# EAGLE design Si1132_breakout (EAGLE 7.2.0)
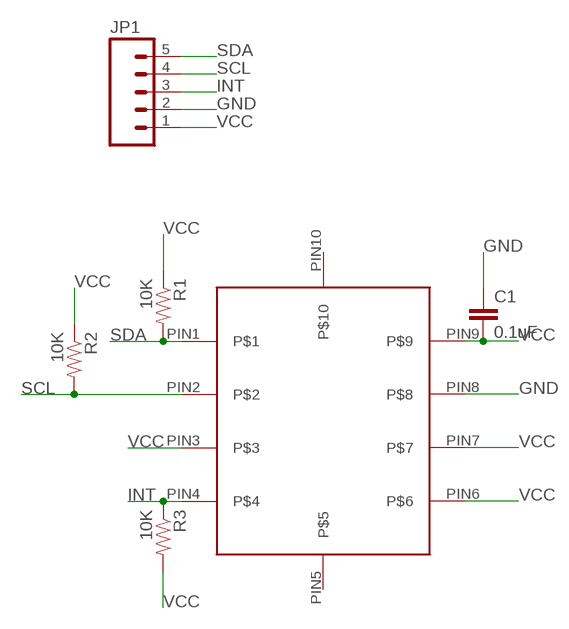
[diagram p0: schematic, sheet 1]

## Parts
C1  0.1uF  CAP0603-CAP  [0603-CAP]
JP1  M05PTH  [1X05]
R1  10K  RESISTOR0603  [0603-RES]
R2  10K  RESISTOR0603  [0603-RES]
R3  10K  RESISTOR0603  [0603-RES]
U$1  SI1132  [SI1132]

## Nets
GND: C1.1 JP1.2 U$1.PIN8
INT: JP1.3 R3.1 U$1.PIN4
SCL: JP1.4 R2.2 U$1.PIN2
SDA: JP1.5 R1.2 U$1.PIN1
VCC: C1.2 JP1.1 R1.1 R2.1 R3.2 U$1.PIN3 U$1.PIN6 U$1.PIN7 U$1.PIN9
Unconnected: U$1.PIN5 U$1.PIN10

## Library data of the parts
C1 = SparkFun-Capacitors:CAP: Capacitor Standard 0603 ceramic capacitor, and 0.1" leaded capacitor.
JP1 = SparkFun-Connectors:M05: Header 5 Standard 5-pin 0.1" header. Use with straight break away headers (SKU : PRT-00116), right angle break away headers (PRT-00553), swiss pins (PRT-00743), machine pins (PRT-00117), and female headers (PRT-00115). Molex polarized connector foot print use with SKU : PRT-08230 with associated crimp pins and housings.
R1-R3 = SparkFun-Resistors:RESISTOR: Resistor Basic schematic elements and footprints for 0603, 1206, and PTH resistors.
U$1 = awqua_eagle_library:SI1132

## Board
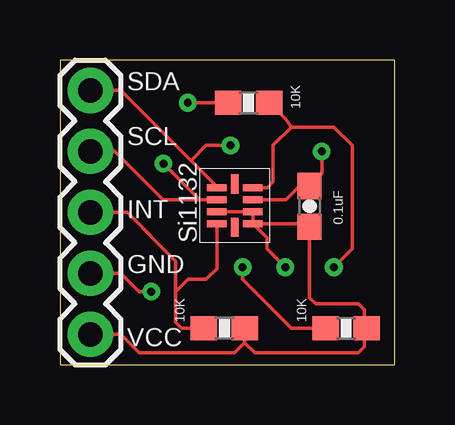
[diagram p1: board, top side]
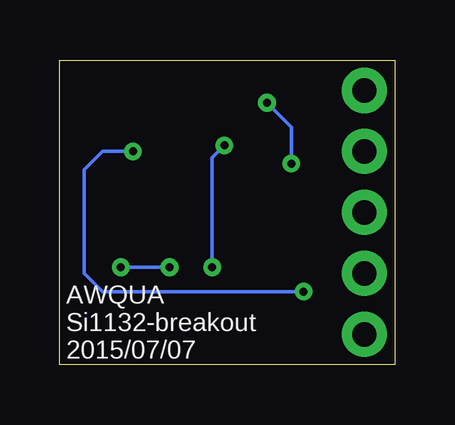
[diagram p2: board, bottom side, seen from below]

Size 13.97 x 12.7 mm. Coordinates in mm from the lower left corner, seen from the top.
Outline: 0,0 13.97,0 13.97,12.7 0,12.69 0,0
Copper layers (1*16): Top 0.035mm / dielectric 1.5mm / Bottom 0.035mm
Design rules "default": minimum track width 10mil, minimum drill 24mil, track to track 8mil, track to pad 8mil, pad to pad 8mil, via to via 8mil, smd to smd 8mil, copper to edge 40mil, drill to drill 8mil, minimum pad ring 10mil, minimum via ring 8mil, stop-mask expansion 4mil, vias tented up to drill 0mil, thermal gap 10mil

### Footprints (pad centres in the part's own frame; a part is rotated, then mirrored left to right if it is on the bottom)
0603-CAP = smd 1.1 x 1: 1 -0.85,0; 2 0.85,0
1X05 = drill 1.016 pad 1.88: 1 0,0; 2 2.54,0; 3 5.08,0; 4 7.62,0; 5 10.16,0
0603-RES = smd 1.1 x 1: 1 -0.85,0; 2 0.85,0
SI1132 = smd 0.8 x 0.3: PIN1 0.7,2.3; PIN2 0.7,1.8; PIN3 0.7,1.3; PIN4 0.7,0.8; PIN6 2.2,0.8; PIN7 2.2,1.3; PIN8 2.2,1.8; PIN9 2.2,2.3 | smd 0.3 x 0.8: PIN5 1.45,0.65; PIN10 1.45,2.45

### Placement (x,y rotation side)
C1  10.41,6.6 270 top
JP1  1.27,1.27 90 top
R1  11.94,1.52 180 top
R2  7.87,10.92 180 top
R3  6.86,1.52 0 top
U$1  5.84,5.08 0 top

### Tracks (layer width: path | path; a pad name or v marks a point on that pad's centre or on a via)
GND  (via drill 0.33)
  Top 0.152: U$1.PIN8 9.42,6.88 9.91,7.37 10.33,7.37 C1.1 10.92,7.96 v10.92,8.89 | JP1.2 2.54,3.81 3.3,3.05 v3.81,3.05
  Bottom 0.152: v3.81,3.05 12.19,3.05 12.95,3.81 12.95,8.13 12.19,8.89 v10.92,8.89
INT
  Top 0.152: U$1.PIN4 6.54,4 6.1,3.56 5.33,3.56 4.83,3.05 | 4.83,3.05 4.83,1.78 5.08,1.52 R3.1 | 4.83,3.05 4.83,4.32 2.79,6.35 JP1.3
SCL  (via drill 0.33)
  Top 0.152: JP1.4 2.29,8.89 4.3,6.88 U$1.PIN2 5.82,6.88 v4.32,8.38 | v5.33,10.92 R2.2
  Bottom 0.152: v4.32,8.38 4.32,9.91 v5.33,10.92
SDA  (via drill 0.33)
  Top 0.152: U$1.PIN1 6.54,7.43 5.46,8.51 | 5.46,8.51 2.54,11.43 JP1.5 | v7.11,9.14 6.1,9.14 5.46,8.51 | R1.2 9.65,1.52 7.62,3.56 v7.62,4.06
  Bottom 0.152: v7.62,4.06 7.62,8.64 v7.11,9.14
VCC  (via drill 0.33)
  Top 0.152: U$1.PIN6 10.29,5.88 C1.2 10.41,2.79 10.67,2.54 12.45,2.54 12.7,2.29 12.7,1.61 R1.1 12.7,1.44 12.7,0.76 12.45,0.51 8.13,0.51 7.71,0.93 | U$1.PIN6 U$1.PIN7 U$1.PIN3 | U$1.PIN9 8.65,7.38 8.89,7.62 8.89,9.14 9.65,9.91 | 9.65,9.91 11.43,9.91 12.19,9.14 12.19,4.83 v11.43,4.06 | v9.4,4.06 8.64,4.83 8.64,5.29 U$1.PIN6 | 9.65,9.91 9.4,10.25 R2.1 | R3.2 7.71,0.93 | JP1.1 2.54,1.27 3.3,0.51 7.29,0.51 7.71,0.93
  Bottom 0.152: v11.43,4.06 v9.4,4.06

### Text on the board
tNames: SDA | SCL | INT | Si1132 | GND | VCC
bNames: AWQUA / Si1132-breakout / 2015/07/07